# Altium schematic sheet MB1389_Top.SchDoc: Top hierarchical view
size A4; Date: Not used; ApprovedBy: Not used; CheckedBy: Not used; Author: Not used; CompanyName: STMicroelectronics; DrawnBy: Not used; Engineer: Not used; Organization: Not used; Address1: Not used; Address2: Not used; Address3: Not used; Address4: Not used; DocumentNumber: 2; Revision: Not used; SheetNumber: 2; SheetTotal: 8; CurrentTime: Not used; CurrentDate: Not used; Time: Not used; DocumentFullPathAndName: Not used; DocumentName: Not used; ModifiedDate: Not used; ImagePath: Not used; ProjectName: Not used; Application_BuildNumber: Not used
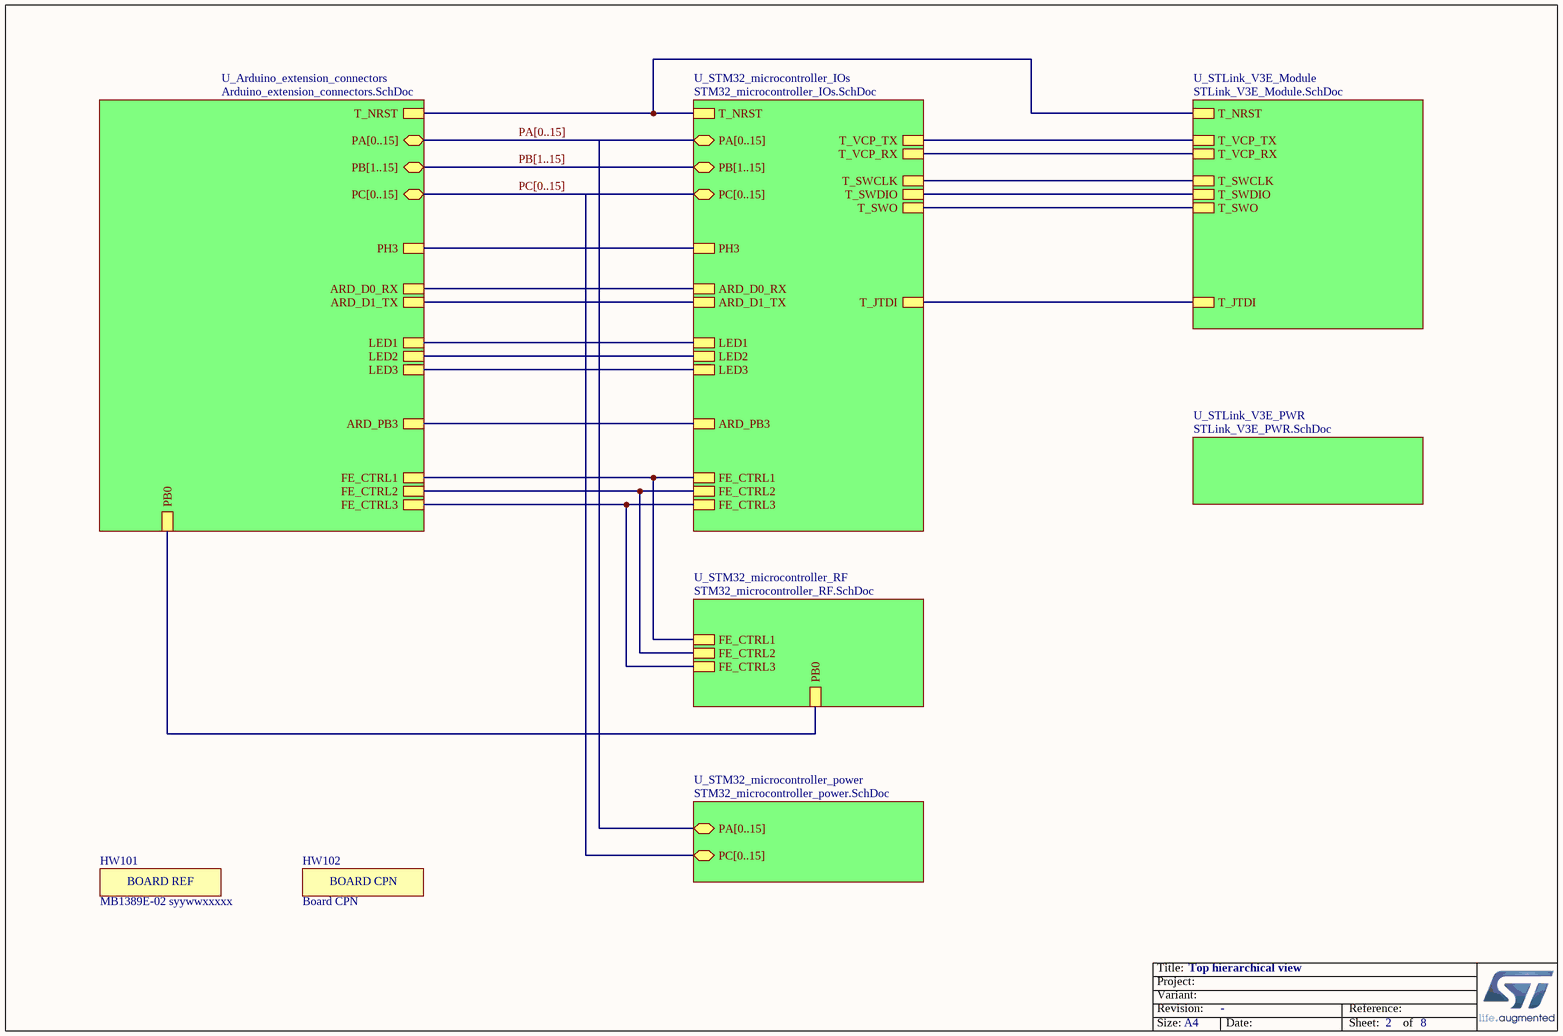
[diagram p0: MB1389_Top.SchDoc]

## Parts
HW101  value MB1389E-02 syywwxxxxx  [STICKER_BOARD-REF_25X5]  (mechanical)
HW102  value Board CPN  [STICKER_BOARD-CPN_25X5]  (mechanical)

## Sub-sheets
U_Arduino_extension_connectors = Arduino_extension_connectors.SchDoc: PA[0..15] (bidir), PB[1..15] (bidir), PC[0..15] (bidir), T_NRST, ARD_D0_RX, ARD_D1_TX, LED1, LED2, LED3, FE_CTRL1, FE_CTRL2, PB0, PH3, FE_CTRL3, ARD_PB3
U_STLink_V3E_Module = STLink_V3E_Module.SchDoc: T_SWCLK, T_SWO, T_NRST, T_SWDIO, T_VCP_TX, T_VCP_RX, T_JTDI
U_STLink_V3E_PWR = STLink_V3E_PWR.SchDoc: no entries
U_STM32_microcontroller_IOs = STM32_microcontroller_IOs.SchDoc: T_NRST, PA[0..15] (bidir), PB[1..15] (bidir), PC[0..15] (bidir), ARD_D0_RX, ARD_D1_TX, T_VCP_TX, T_VCP_RX, T_SWCLK, T_SWO, T_SWDIO, T_JTDI, FE_CTRL2, FE_CTRL1, LED1, LED2, LED3, PH3, FE_CTRL3, ARD_PB3
U_STM32_microcontroller_power = STM32_microcontroller_power.SchDoc: PA[0..15] (bidir), PC[0..15] (bidir)
U_STM32_microcontroller_RF = STM32_microcontroller_RF.SchDoc: FE_CTRL2, FE_CTRL1, PB0, FE_CTRL3

## Nets
(unnamed): sheet U_STM32_microcontroller_IOs/T_NRST, sheet U_STLink_V3E_Module/T_NRST, sheet U_Arduino_extension_connectors/T_NRST
(unnamed): sheet U_STM32_microcontroller_IOs/ARD_D0_RX, sheet U_Arduino_extension_connectors/ARD_D0_RX
(unnamed): sheet U_STM32_microcontroller_IOs/ARD_D1_TX, sheet U_Arduino_extension_connectors/ARD_D1_TX
(unnamed): sheet U_STM32_microcontroller_IOs/T_VCP_TX, sheet U_STLink_V3E_Module/T_VCP_TX
(unnamed): sheet U_STM32_microcontroller_IOs/T_VCP_RX, sheet U_STLink_V3E_Module/T_VCP_RX
(unnamed): sheet U_STM32_microcontroller_IOs/T_SWCLK, sheet U_STLink_V3E_Module/T_SWCLK
(unnamed): sheet U_STM32_microcontroller_IOs/T_SWO, sheet U_STLink_V3E_Module/T_SWO
(unnamed): sheet U_STM32_microcontroller_IOs/T_SWDIO, sheet U_STLink_V3E_Module/T_SWDIO
(unnamed): sheet U_STM32_microcontroller_IOs/T_JTDI, sheet U_STLink_V3E_Module/T_JTDI
(unnamed): sheet U_STM32_microcontroller_IOs/FE_CTRL2, sheet U_Arduino_extension_connectors/FE_CTRL2, sheet U_STM32_microcontroller_RF/FE_CTRL2
(unnamed): sheet U_STM32_microcontroller_IOs/FE_CTRL1, sheet U_Arduino_extension_connectors/FE_CTRL1, sheet U_STM32_microcontroller_RF/FE_CTRL1
(unnamed): sheet U_STM32_microcontroller_IOs/LED1, sheet U_Arduino_extension_connectors/LED1
(unnamed): sheet U_STM32_microcontroller_IOs/LED2, sheet U_Arduino_extension_connectors/LED2
(unnamed): sheet U_STM32_microcontroller_IOs/LED3, sheet U_Arduino_extension_connectors/LED3
(unnamed): sheet U_STM32_microcontroller_IOs/PH3, sheet U_Arduino_extension_connectors/PH3
(unnamed): sheet U_STM32_microcontroller_IOs/FE_CTRL3, sheet U_Arduino_extension_connectors/FE_CTRL3, sheet U_STM32_microcontroller_RF/FE_CTRL3
(unnamed): sheet U_STM32_microcontroller_IOs/ARD_PB3, sheet U_Arduino_extension_connectors/ARD_PB3
(unnamed): sheet U_Arduino_extension_connectors/PB0, sheet U_STM32_microcontroller_RF/PB0

## Buses and harness runs
bus PA[0..15] = sheet U_Arduino_extension_connectors/PA[0..15] = sheet U_STM32_microcontroller_IOs/PA[0..15] = sheet U_STM32_microcontroller_power/PA[0..15]
bus PB[1..15] = sheet U_Arduino_extension_connectors/PB[1..15] = sheet U_STM32_microcontroller_IOs/PB[1..15]
bus PC[0..15] = sheet U_Arduino_extension_connectors/PC[0..15] = sheet U_STM32_microcontroller_IOs/PC[0..15] = sheet U_STM32_microcontroller_power/PC[0..15]

## Notes on the sheet
- Title:
- Project:
- Size:
- Revision:
- Variant:
- A4
- -
- Date:
- Reference:
- Sheet:
- of
- (in symbol MCD-00235) BOARD REF
- (in symbol MCD-00547) BOARD CPN

## Library data of the parts
HW101 = MCD-00235: Board sticker to mention board reference + serial number + QR code; Part_Type: Mechanical; Provided_By: SUBCO; Initial_Board_Reference: MB1319; Internal_Part_Number: MCD-00235; Status: Released; Manufacturer_Part_Number: n/a; Manufacturer: n/a; ComponentLink1Description: Datasheet; ComponentLink1URL: n/a
HW102 = MCD-00547: Product sticker to mention product CPN + product FG; Part_Type: Mechanical; Provided_By: SUBCO; Initial_Board_Reference: MB1319; Remark: PCH W35 footprint requested to have a space on board for stickers.; Internal_Part_Number: MCD-00547; Status: Released; Manufacturer_Part_Number: n/a; Manufacturer: n/a; ComponentLink1Description: Datasheet; ComponentLink1URL: NA